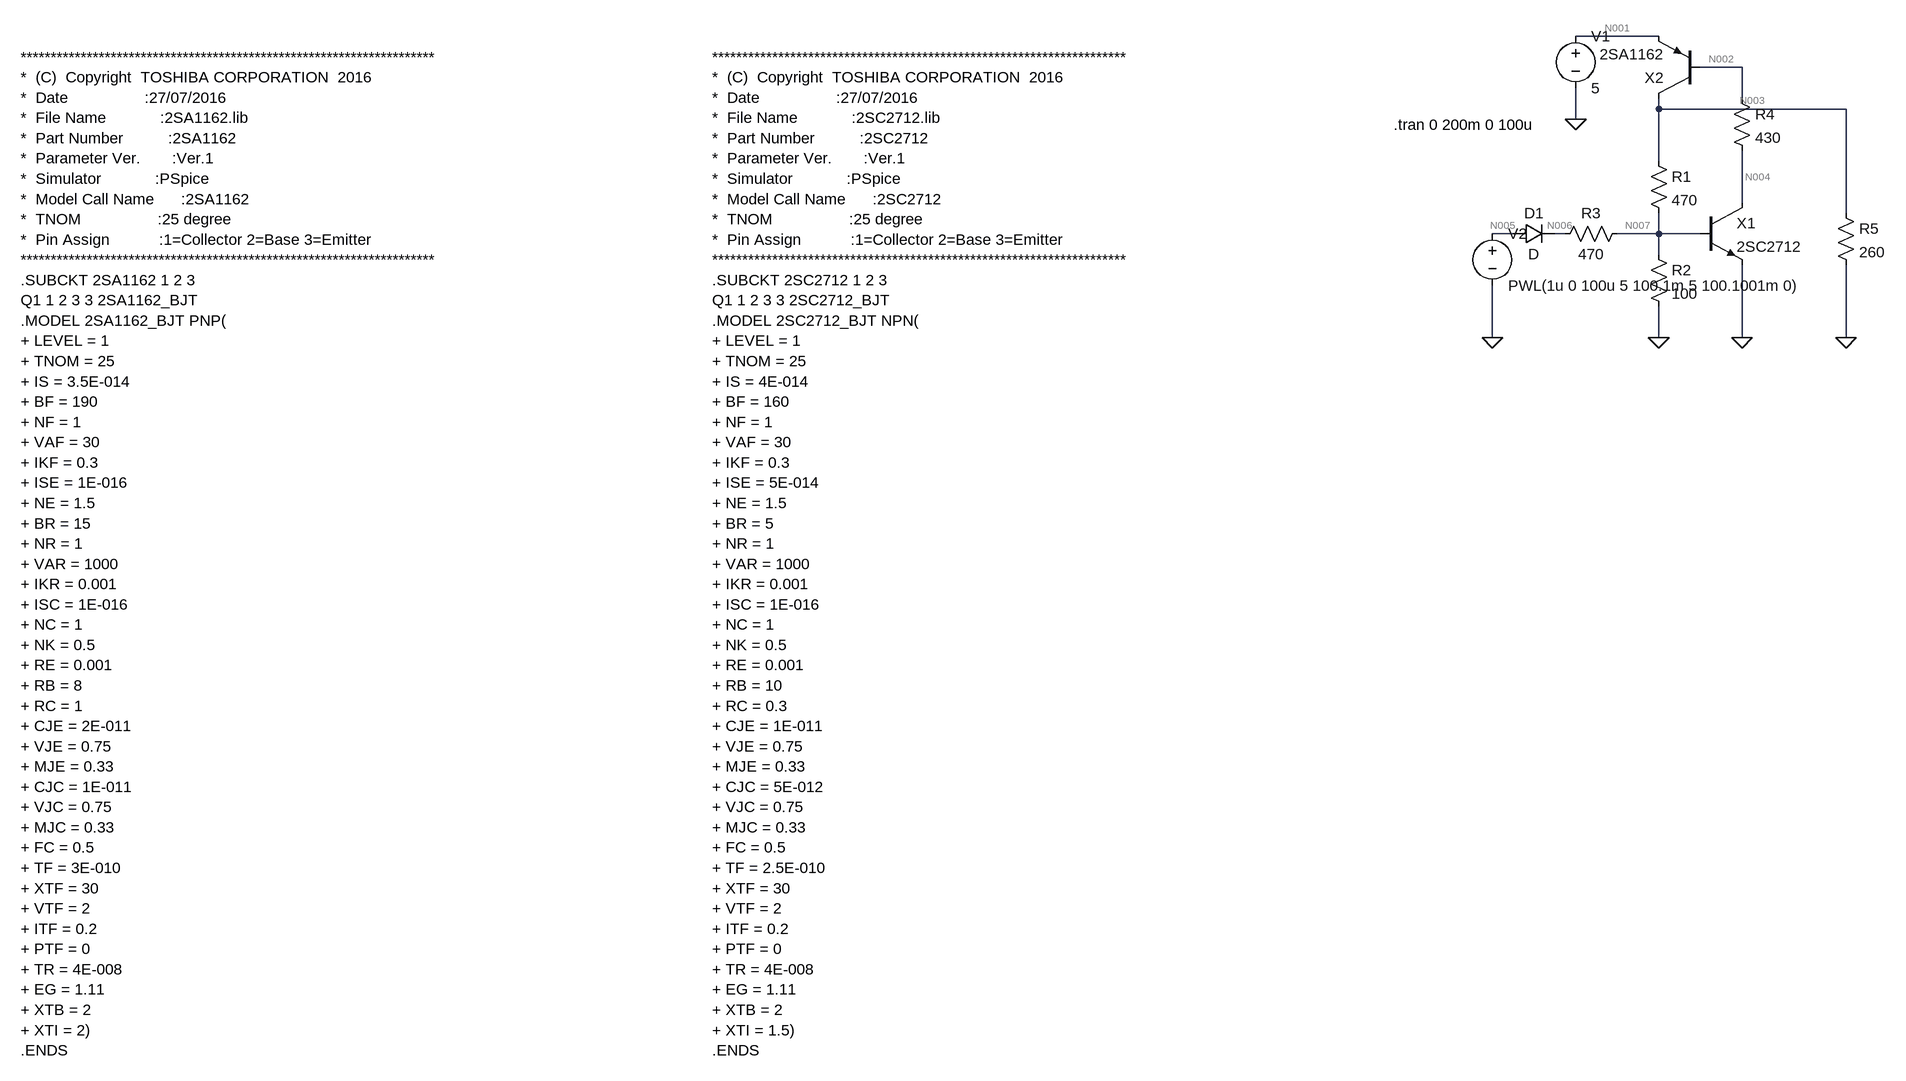
[diagram p0: schematic EMS_with_override.asc]
EMS_with_override.asc, the LTspice schematic file:
Version 4
SHEET 1 1884 1436
WIRE 1360 16 1232 16
WIRE 1488 64 1424 64
WIRE 1488 112 1488 64
WIRE 1360 128 1360 112
WIRE 1648 128 1360 128
WIRE 1232 144 1232 96
WIRE 1360 208 1360 128
WIRE 1488 272 1488 192
WIRE 1648 288 1648 128
WIRE 1136 320 1104 320
WIRE 1216 320 1200 320
WIRE 1360 320 1360 288
WIRE 1360 320 1296 320
WIRE 1424 320 1360 320
WIRE 1360 352 1360 320
WIRE 1104 480 1104 400
WIRE 1360 480 1360 432
WIRE 1488 480 1488 368
WIRE 1648 480 1648 368
FLAG 1104 480 0
FLAG 1360 480 0
FLAG 1488 480 0
FLAG 1232 144 0
FLAG 1648 480 0
SYMBOL res 1344 192 R0
SYMATTR InstName R1
SYMATTR Value 470
SYMBOL res 1344 336 R0
SYMATTR InstName R2
SYMATTR Value 100
SYMBOL res 1312 304 R90
WINDOW 0 0 56 VBottom 2
WINDOW 3 32 56 VTop 2
SYMATTR InstName R3
SYMATTR Value 470
SYMBOL npn 1424 272 R0
SYMATTR InstName X1
SYMATTR Value 2SC2712
SYMATTR Prefix X
SYMBOL res 1472 96 R0
SYMATTR InstName R4
SYMATTR Value 430
SYMBOL pnp 1424 112 R180
SYMATTR InstName X2
SYMATTR Value 2SA1162
SYMATTR Prefix X
SYMBOL voltage 1232 0 R0
WINDOW 123 0 0 Left 0
WINDOW 39 0 0 Left 0
SYMATTR InstName V1
SYMATTR Value 5
SYMBOL voltage 1104 304 R0
WINDOW 123 0 0 Left 0
WINDOW 39 0 0 Left 0
SYMATTR InstName V2
SYMATTR Value PWL(1u 0 100u 5 100.1m 5 100.1001m 0)
SYMBOL diode 1136 336 R270
WINDOW 0 32 32 VTop 2
WINDOW 3 0 32 VBottom 2
SYMATTR InstName D1
SYMBOL res 1632 272 R0
SYMATTR InstName R5
SYMATTR Value 260
TEXT -96 48 Left 2 !*********************************************************************\n*  (C)  Copyright  TOSHIBA CORPORATION  2016\n*  Date                 :27/07/2016\n*  File Name            :2SC2712.lib\n*  Part Number          :2SC2712\n*  Parameter Ver.       :Ver.1\n*  Simulator            :PSpice\n*  Model Call Name      :2SC2712\n*  TNOM                 :25 degree\n*  Pin Assign           :1=Collector 2=Base 3=Emitter\n*********************************************************************\n.SUBCKT 2SC2712 1 2 3\nQ1 1 2 3 3 2SC2712_BJT\n.MODEL 2SC2712_BJT NPN(\n+ LEVEL = 1 \n+ TNOM = 25\n+ IS = 4E-014 \n+ BF = 160 \n+ NF = 1 \n+ VAF = 30 \n+ IKF = 0.3 \n+ ISE = 5E-014 \n+ NE = 1.5 \n+ BR = 5 \n+ NR = 1 \n+ VAR = 1000 \n+ IKR = 0.001 \n+ ISC = 1E-016 \n+ NC = 1 \n+ NK = 0.5 \n+ RE = 0.001 \n+ RB = 10 \n+ RC = 0.3 \n+ CJE = 1E-011 \n+ VJE = 0.75 \n+ MJE = 0.33 \n+ CJC = 5E-012 \n+ VJC = 0.75 \n+ MJC = 0.33 \n+ FC = 0.5 \n+ TF = 2.5E-010 \n+ XTF = 30 \n+ VTF = 2 \n+ ITF = 0.2 \n+ PTF = 0 \n+ TR = 4E-008 \n+ EG = 1.11 \n+ XTB = 2 \n+ XTI = 1.5)\n.ENDS
TEXT -1160 48 Left 2 !*********************************************************************\n*  (C)  Copyright  TOSHIBA CORPORATION  2016\n*  Date                 :27/07/2016\n*  File Name            :2SA1162.lib\n*  Part Number          :2SA1162\n*  Parameter Ver.       :Ver.1\n*  Simulator            :PSpice\n*  Model Call Name      :2SA1162\n*  TNOM                 :25 degree\n*  Pin Assign           :1=Collector 2=Base 3=Emitter\n*********************************************************************\n.SUBCKT 2SA1162 1 2 3\nQ1 1 2 3 3 2SA1162_BJT\n.MODEL 2SA1162_BJT PNP(\n+ LEVEL = 1 \n+ TNOM = 25\n+ IS = 3.5E-014 \n+ BF = 190 \n+ NF = 1 \n+ VAF = 30 \n+ IKF = 0.3 \n+ ISE = 1E-016 \n+ NE = 1.5 \n+ BR = 15 \n+ NR = 1 \n+ VAR = 1000 \n+ IKR = 0.001 \n+ ISC = 1E-016 \n+ NC = 1 \n+ NK = 0.5 \n+ RE = 0.001 \n+ RB = 8 \n+ RC = 1 \n+ CJE = 2E-011 \n+ VJE = 0.75 \n+ MJE = 0.33 \n+ CJC = 1E-011 \n+ VJC = 0.75 \n+ MJC = 0.33 \n+ FC = 0.5 \n+ TF = 3E-010 \n+ XTF = 30 \n+ VTF = 2 \n+ ITF = 0.2 \n+ PTF = 0 \n+ TR = 4E-008 \n+ EG = 1.11 \n+ XTB = 2 \n+ XTI = 2)\n.ENDS
TEXT 952 152 Left 2 !.tran 0 200m 0 100u

The netlist it stands for:
* EMS_with_override.asc
R1 N003 N007 470
R2 N007 0 100
R3 N007 N006 470
XX1 N004 N007 0 2SC2712  ; pins C B E
R4 N002 N004 430
XX2 N003 N002 N001 2SA1162  ; pins C B E
V1 N001 0 5
V2 N005 0 PWL(1u 0 100u 5 100.1m 5 100.1001m 0)
D1 N005 N006 D
R5 N003 0 260
.model D D
.lib standard.dio
*********************************************************************
*  (C)  Copyright  TOSHIBA CORPORATION  2016
*  Date                 :27/07/2016
*  File Name            :2SC2712.lib
*  Part Number          :2SC2712
*  Parameter Ver.       :Ver.1
*  Simulator            :PSpice
*  Model Call Name      :2SC2712
*  TNOM                 :25 degree
*  Pin Assign           :1=Collector 2=Base 3=Emitter
*********************************************************************
.SUBCKT 2SC2712 1 2 3
Q1 1 2 3 3 2SC2712_BJT
.MODEL 2SC2712_BJT NPN(
+ LEVEL = 1
+ TNOM = 25
+ IS = 4E-014
+ BF = 160
+ NF = 1
+ VAF = 30
+ IKF = 0.3
+ ISE = 5E-014
+ NE = 1.5
+ BR = 5
+ NR = 1
+ VAR = 1000
+ IKR = 0.001
+ ISC = 1E-016
+ NC = 1
+ NK = 0.5
+ RE = 0.001
+ RB = 10
+ RC = 0.3
+ CJE = 1E-011
+ VJE = 0.75
+ MJE = 0.33
+ CJC = 5E-012
+ VJC = 0.75
+ MJC = 0.33
+ FC = 0.5
+ TF = 2.5E-010
+ XTF = 30
+ VTF = 2
+ ITF = 0.2
+ PTF = 0
+ TR = 4E-008
+ EG = 1.11
+ XTB = 2
+ XTI = 1.5)
.ENDS
*********************************************************************
*  (C)  Copyright  TOSHIBA CORPORATION  2016
*  Date                 :27/07/2016
*  File Name            :2SA1162.lib
*  Part Number          :2SA1162
*  Parameter Ver.       :Ver.1
*  Simulator            :PSpice
*  Model Call Name      :2SA1162
*  TNOM                 :25 degree
*  Pin Assign           :1=Collector 2=Base 3=Emitter
*********************************************************************
.SUBCKT 2SA1162 1 2 3
Q1 1 2 3 3 2SA1162_BJT
.MODEL 2SA1162_BJT PNP(
+ LEVEL = 1
+ TNOM = 25
+ IS = 3.5E-014
+ BF = 190
+ NF = 1
+ VAF = 30
+ IKF = 0.3
+ ISE = 1E-016
+ NE = 1.5
+ BR = 15
+ NR = 1
+ VAR = 1000
+ IKR = 0.001
+ ISC = 1E-016
+ NC = 1
+ NK = 0.5
+ RE = 0.001
+ RB = 8
+ RC = 1
+ CJE = 2E-011
+ VJE = 0.75
+ MJE = 0.33
+ CJC = 1E-011
+ VJC = 0.75
+ MJC = 0.33
+ FC = 0.5
+ TF = 3E-010
+ XTF = 30
+ VTF = 2
+ ITF = 0.2
+ PTF = 0
+ TR = 4E-008
+ EG = 1.11
+ XTB = 2
+ XTI = 2)
.ENDS
.tran 0 200m 0 100u
.backanno
.end

* Results of the author's LTspice run, read from the files saved beside the schematic
* Operating Point, zero values left out:
*   V(n003) = 4.932 V
*   V(n007) = 725.9 mV
*   V(n006) = 725.9 mV
*   V(n004) = 49.7 mV
*   V(n002) = 4.149 V
*   V(n001) = 5 V
*   I(R1) = 8.949 mA
*   I(R2) = 7.259 mA
*   I(R4) = 9.533 mA
*   I(R5) = 18.97 mA
*   I(V1) = -37.45 mA
*   Ix(x1:1) = 9.533 mA
*   Ix(x1:2) = 1.689 mA
*   Ix(x1:3) = -11.22 mA
*   Ix(x2:1) = -27.92 mA
*   Ix(x2:2) = -9.533 mA
*   Ix(x2:3) = 37.45 mA
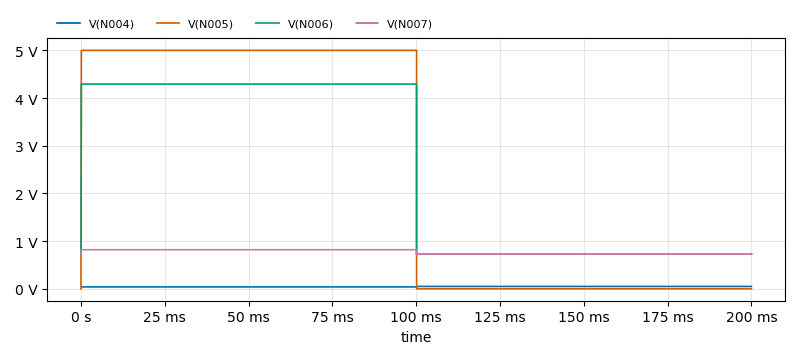
[diagram p1: Transient Analysis of EMS_with_override.asc, plotted from the saved traces]
* Transient Analysis, 1 run:
*   V(N004): min 33.24 mV, max 49.7 mV, average 44.65 mV, rms 44.93 mV, last 49.7 mV
*   V(N005): min 0 V, max 5 V, average 2.501 V, rms 3.536 V, last 0 V
*   V(N006): min 725.9 mV, max 4.293 V, average 2.51 V, rms 3.079 V, last 725.9 mV
*   V(N007): min 725.9 mV, max 819.8 mV, average 772.9 mV, rms 774.3 mV, last 725.9 mV